# EAGLE design Nexys 2 Port Expansion Pack (EAGLE 6.5.0)
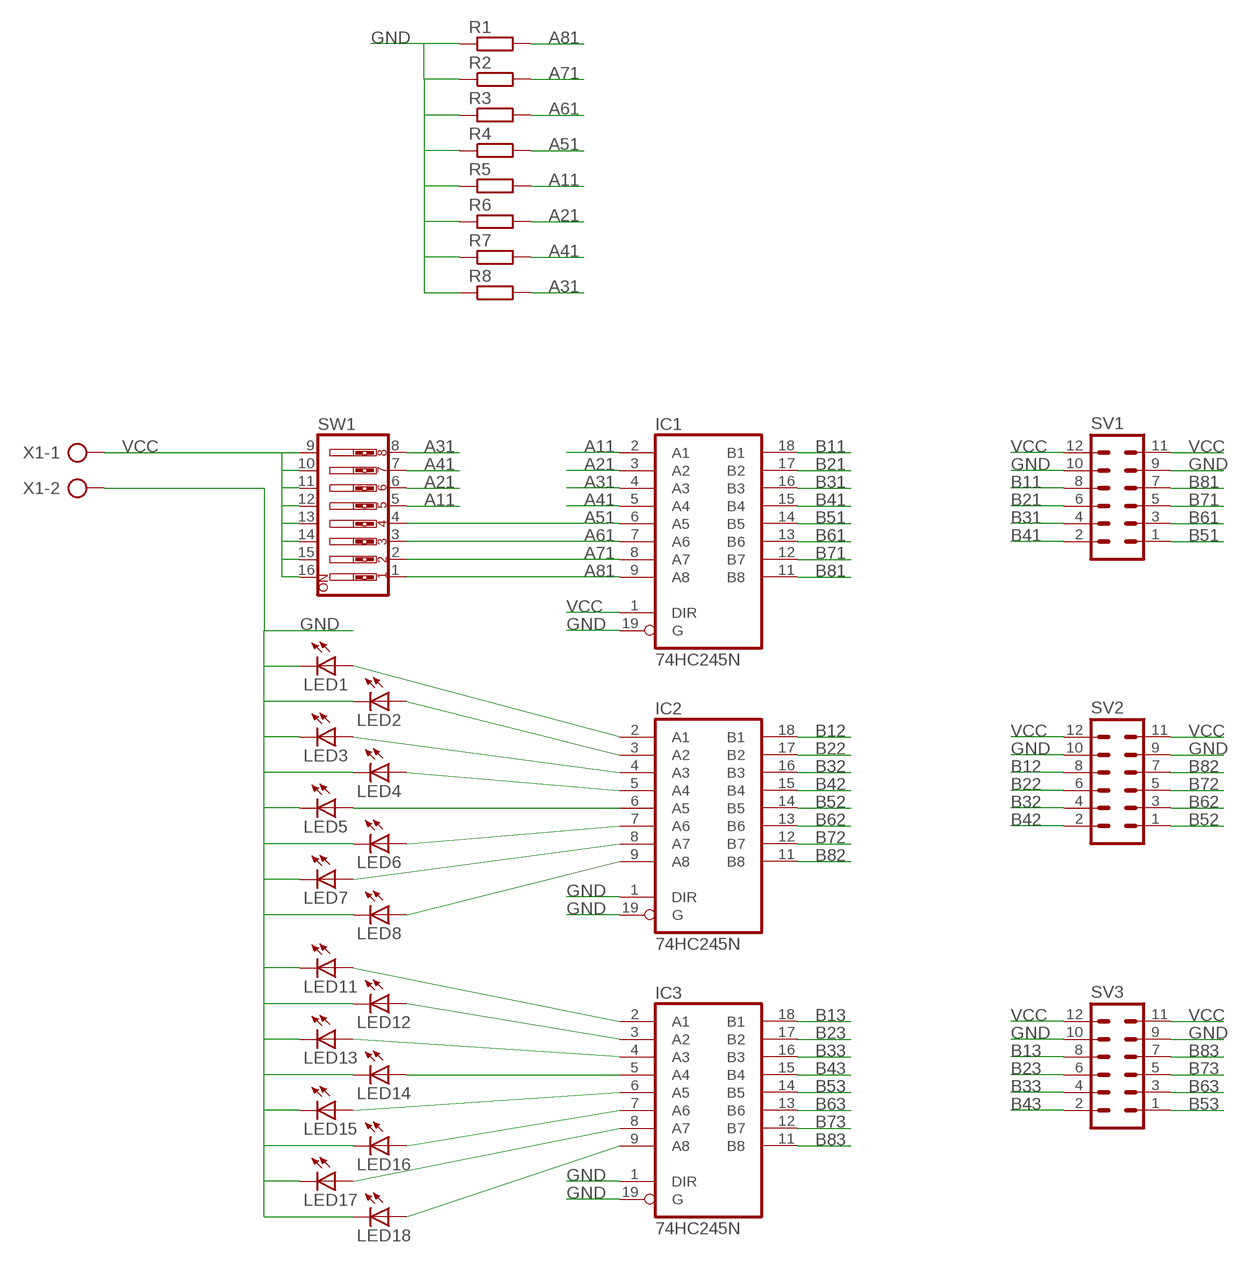
[diagram p0: schematic, sheet 1]

## Parts
IC1  74HC245N  [DIL20]
IC2  74HC245N  [DIL20]
IC3  74HC245N  [DIL20]
LED1  LED3MM  [LED3MM]
LED2  LED3MM  [LED3MM]
LED3  LED3MM  [LED3MM]
LED4  LED3MM  [LED3MM]
LED5  LED3MM  [LED3MM]
LED6  LED3MM  [LED3MM]
LED7  LED3MM  [LED3MM]
LED8  LED3MM  [LED3MM]
LED11  LED3MM  [LED3MM]
LED12  LED3MM  [LED3MM]
LED13  LED3MM  [LED3MM]
LED14  LED3MM  [LED3MM]
LED15  LED3MM  [LED3MM]
LED16  LED3MM  [LED3MM]
LED17  LED3MM  [LED3MM]
LED18  LED3MM  [LED3MM]
R1  R-EU_0207/15  [0207/15]
R2  R-EU_0207/15  [0207/15]
R3  R-EU_0207/15  [0207/15]
R4  R-EU_0207/15  [0207/15]
R5  R-EU_0207/15  [0207/15]
R6  R-EU_0207/15  [0207/15]
R7  R-EU_0207/15  [0207/15]
R8  R-EU_0207/15  [0207/15]
SV1  MA06-2  [MA06-2]
SV2  MA06-2  [MA06-2]
SV3  MA06-2  [MA06-2]
SW1  SW_DIP-8  [EDG-08]
X1  AK500/2  [AK500/2]

## Nets
A11: IC1.2(A1) R5.2 SW1.5
A21: IC1.3(A2) R6.2 SW1.6
A31: IC1.4(A3) R8.2 SW1.8
A41: IC1.5(A4) R7.2 SW1.7
A51: IC1.6(A5) R4.2 SW1.4
A61: IC1.7(A6) R3.2 SW1.3
A71: IC1.8(A7) R2.2 SW1.2
A81: IC1.9(A8) R1.2 SW1.1
B11: IC1.18(B1) SV1.8
B12: IC2.18(B1) SV2.8
B13: IC3.18(B1) SV3.8
B21: IC1.17(B2) SV1.6
B22: IC2.17(B2) SV2.6
B23: IC3.17(B2) SV3.6
B31: IC1.16(B3) SV1.4
B32: IC2.16(B3) SV2.4
B33: IC3.16(B3) SV3.4
B41: IC1.15(B4) SV1.2
B42: IC2.15(B4) SV2.2
B43: IC3.15(B4) SV3.2
B51: IC1.14(B5) SV1.1
B52: IC2.14(B5) SV2.1
B53: IC3.14(B5) SV3.1
B61: IC1.13(B6) SV1.3
B62: IC2.13(B6) SV2.3
B63: IC3.13(B6) SV3.3
B71: IC1.12(B7) SV1.5
B72: IC2.12(B7) SV2.5
B73: IC3.12(B7) SV3.5
B81: IC1.11(B8) SV1.7
B82: IC2.11(B8) SV2.7
B83: IC3.11(B8) SV3.7
GND: IC1.19(G) IC2.1(DIR) IC2.19(G) IC3.1(DIR) IC3.19(G) LED1.K(C) LED2.K(C) LED3.K(C) LED4.K(C) LED5.K(C) LED6.K(C) LED7.K(C) LED8.K(C) LED11.K(C) LED12.K(C) LED13.K(C) LED14.K(C) LED15.K(C) LED16.K(C) LED17.K(C) LED18.K(C) R1.1 R2.1 R3.1 R4.1 R5.1 R6.1 R7.1 R8.1 SV1.9 SV1.10 SV2.9 SV2.10 SV3.9 SV3.10 X1.2
N$12: IC2.2(A1) LED1.A
N$22: IC2.3(A2) LED2.A
N$23: IC3.2(A1) LED11.A
N$24: IC2.4(A3) LED3.A
N$25: IC2.5(A4) LED4.A
N$26: IC2.6(A5) LED5.A
N$27: IC2.7(A6) LED6.A
N$28: IC2.8(A7) LED7.A
N$29: IC2.9(A8) LED8.A
N$30: IC3.3(A2) LED12.A
N$31: IC3.4(A3) LED13.A
N$32: IC3.5(A4) LED14.A
N$33: IC3.6(A5) LED15.A
N$34: IC3.7(A6) LED16.A
N$35: IC3.8(A7) LED17.A
N$36: IC3.9(A8) LED18.A
VCC: IC1.1(DIR) SV1.11 SV1.12 SV2.11 SV2.12 SV3.11 SV3.12 SW1.9 SW1.10 SW1.11 SW1.12 SW1.13 SW1.14 SW1.15 SW1.16 X1.1

## Power pins joined to a net without a drawn wire
GND: IC1.10(GND) IC2.10(GND) IC3.10(GND)
VCC: IC1.20(VCC) IC2.20(VCC) IC3.20(VCC)

## Library data of the parts
IC1-IC3 = 74xx-eu:74*245: Octal BUS TRANSCEIVER, 3-state
LED1-LED8 LED11-LED18 = led:LED: LED OSRAM: - CHIPLED LG R971, LG N971, LY N971, LG Q971, LY Q971, LO R971, LY R971 LH N974, LH R974 LS Q976, LO Q976, LY Q976 LO Q996 - Hyper CHIPLED LW Q18S LB Q993, LB Q99A, LB R99A - SideLED LS A670, LO A670, LY A670, LG A670, LP A670 LB A673, LV A673, LT A673, LW A673 LH A674 LY A675 LS A676, LA A676, LO A676, LY A676, LW A676 LS A679, LY A679, LG A679 - Hyper Micro SIDELED® LS Y876, LA Y876, LO Y876, LY Y876 LT Y87S - SmartLED LW L88C, LW L88S LB L89C, LB L89S, LG L890 LS L89K, LO L89K, LY L89K LS L896, LA L896, LO L896, LY L896 - TOPLED LS T670, LO T670, LY T670, LG T670, LP T670 LSG T670, LSP T670, LSY T670, LOP T670, LYG T670 LG T671, LOG T671, LSG T671 LB T673, LV T673, LT T673, LW T673 LH T674 LS T676, LA T676, LO T676, LY T676, LB T676, LH T676, LSB T676, LW T676 LB T67C, LV T67C, LT T67C, LS T67K, LO T67K, LY T67K, LW E67C LS E67B, LA E67B, LO E67B, LY E67B, LB E67C, LV E67C, LT E67C LW T67C LS T679, LY T679, LG T679 LS T770, LO T770, LY T770, LG T770, LP T770 LB T773, LV T773, LT T773, LW T773 LH T774 LS E675, LA E675, LY E675, LS T675 LS T776, LA T776, LO T776, LY T776, LB T776 LHGB T686 LT T68C, LB T68C - Hyper Mini TOPLED® LB M676 - Mini TOPLED Santana® LG M470 LS M47K, LO M47K, LY M47K Source: http://www.osram.convergy.de LUXEON: - LUMILED® LXK2-PW12-R00, LXK2-PW12-S00, LXK2-PW14-U00, LXK2-PW14-V00 LXK2-PM12-R00, LXK2-PM12-S00, LXK2-PM14-U00 LXK2-PE12-Q00, LXK2-PE12-R00, LXK2-PE12-S00, LXK2-PE14-T00, LXK2-PE14-U00 LXK2-PB12-K00, LXK2-PB12-L00, LXK2-PB12-M00, LXK2-PB14-N00, LXK2-PB14-P00, LXK2-PB14-Q00 LXK2-PR12-L00, LXK2-PR12-M00, LXK2-PR14-Q00, LXK2-PR14-R00 LXK2-PD12-Q00, LXK2-PD12-R00, LXK2-PD12-S00 LXK2-PH12-R00, LXK2-PH12-S00 LXK2-PL12-P00, LXK2-PL12-Q00, LXK2-PL12-R00 Source: www.luxeon.com KINGBRIGHT: KA-3528ASYC Source: www.kingbright.com
R1-R8 = resistor:R-EU_: RESISTOR, European symbol
SV1-SV3 = con-lstb:MA06-2: PIN HEADER; OC_FARNELL: unknown; OC_NEWARK: unknown
SW1 = special:SW_DIP-8: DIP SWITCH
X1 = con-ptr500:AK500/2: CONNECTOR; OC_FARNELL: unknown; OC_NEWARK: unknown

## Board
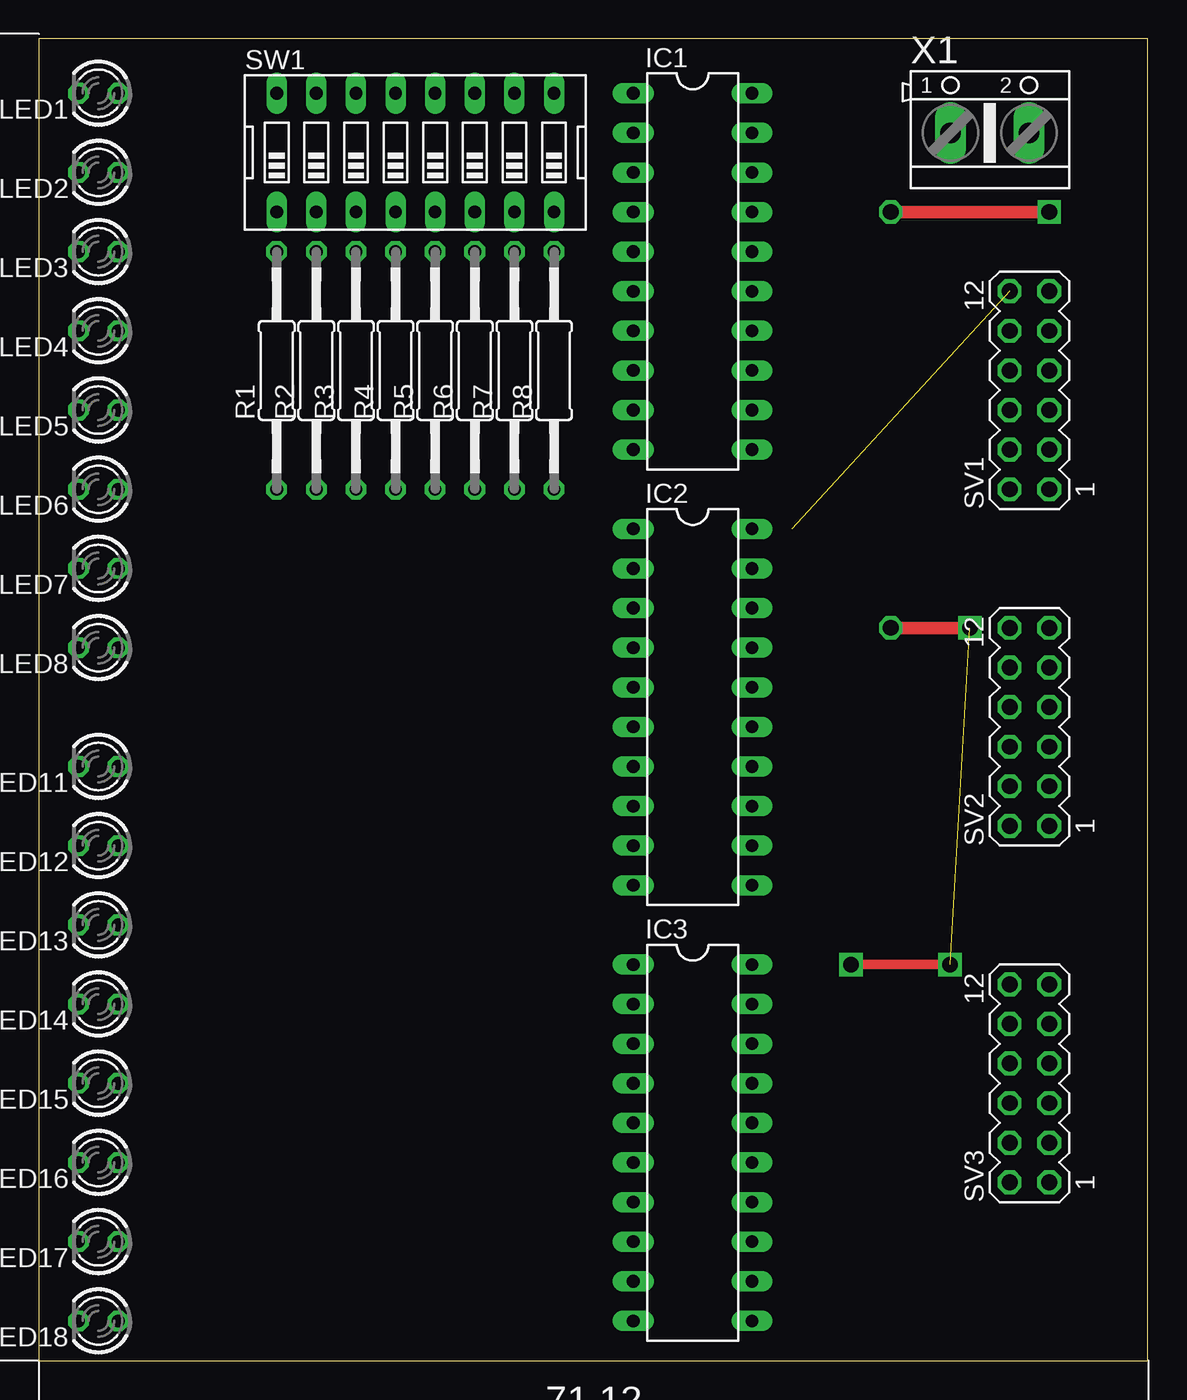
[diagram p1: board, top side]
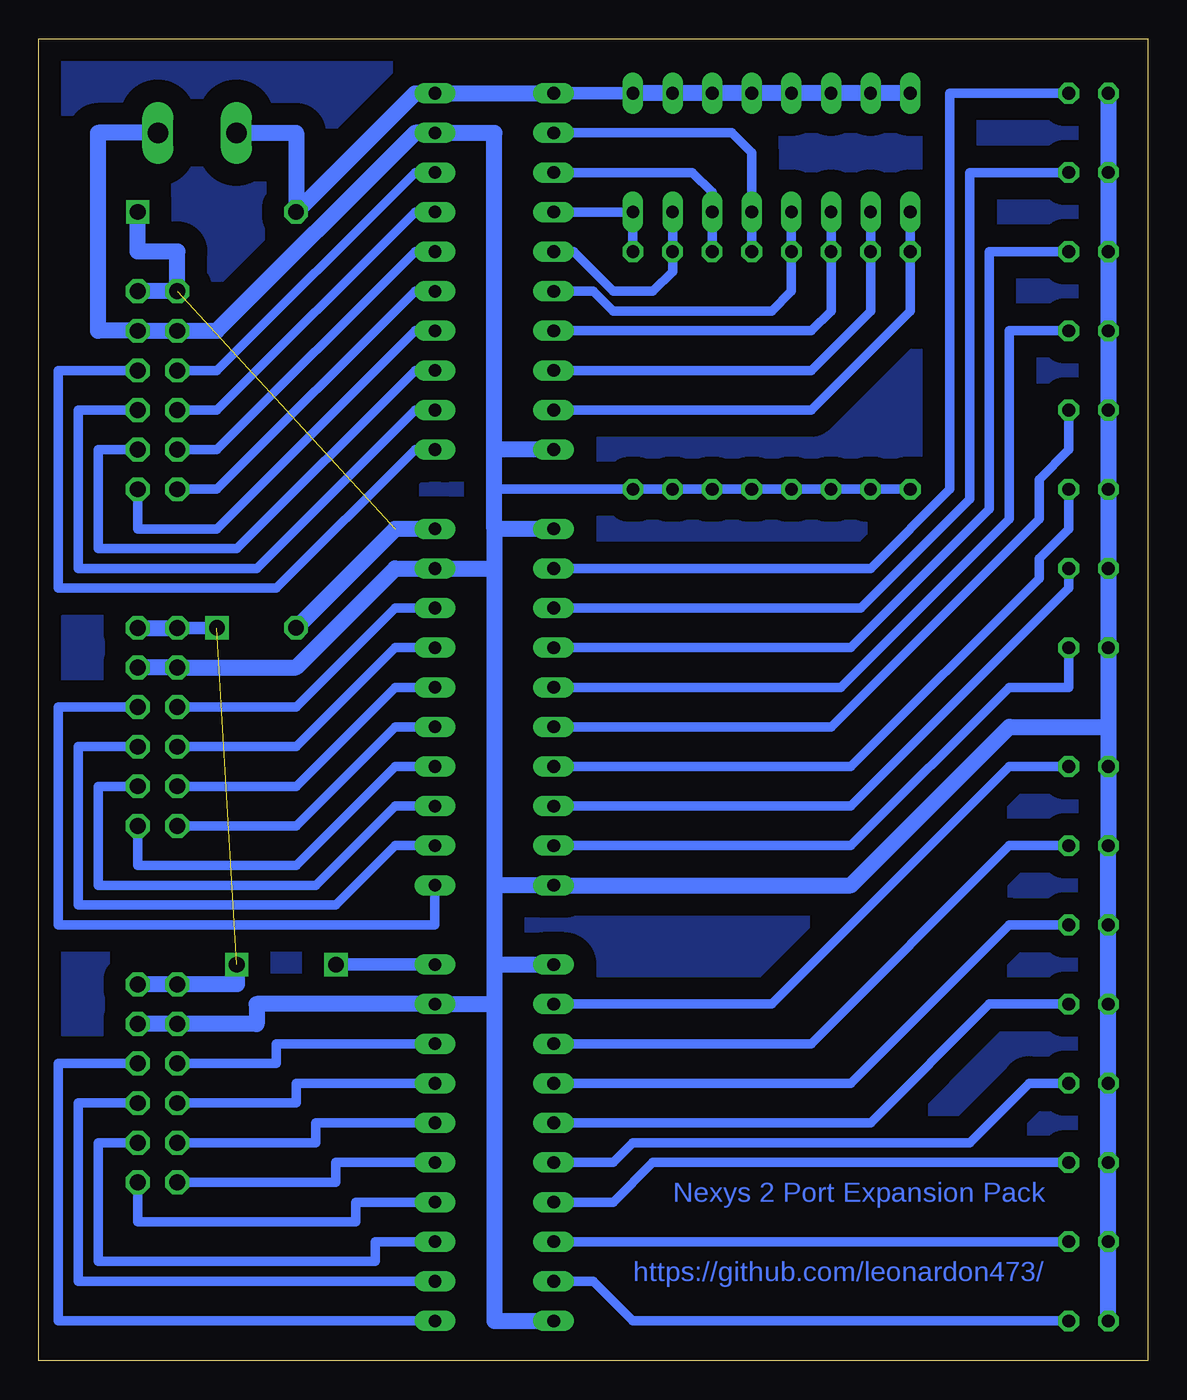
[diagram p2: board, bottom side, seen from below]

Size 71.1 x 84.76 mm. Coordinates in mm from the lower left corner, seen from the top.
Outline: 0,0 71.1,0 71.1,84.76 0,84.76 0,0
Copper layers (1*16): Top 0.035mm / dielectric 1.5mm / Bottom 0.035mm
Design rules "default": minimum track width 10mil, minimum drill 24mil, track to track 8mil, track to pad 8mil, pad to pad 8mil, via to via 8mil, smd to smd 8mil, copper to edge 40mil, drill to drill 8mil, minimum pad ring 10mil, minimum via ring 8mil, stop-mask expansion 4mil, vias tented up to drill 0mil, thermal gap 10mil

### Footprints (pad centres in the part's own frame; a part is rotated, then mirrored left to right if it is on the bottom)
DIL20 = drill 0.813 long: 1 -11.43,-3.81; 2 -8.89,-3.81; 3 -6.35,-3.81; 4 -3.81,-3.81; 5 -1.27,-3.81; 6 1.27,-3.81; 7 3.81,-3.81; 8 6.35,-3.81; 9 8.89,-3.81; 10 11.43,-3.81; 11 11.43,3.81; 12 8.89,3.81; 13 6.35,3.81; 14 3.81,3.81; 15 1.27,3.81; 16 -1.27,3.81; 17 -3.81,3.81; 18 -6.35,3.81; 19 -8.89,3.81; 20 -11.43,3.81
LED3MM = drill 0.813 octagon: A -1.27,0; K 1.27,0
0207/15 = drill 0.813 octagon: 1 -7.62,0; 2 7.62,0
MA06-2 = drill 1.016 octagon: 1 -6.35,-1.27; 2 -6.35,1.27; 3 -3.81,-1.27; 4 -3.81,1.27; 5 -1.27,-1.27; 6 -1.27,1.27; 7 1.27,-1.27; 8 1.27,1.27; 9 3.81,-1.27; 10 3.81,1.27; 11 6.35,-1.27; 12 6.35,1.27
EDG-08 = drill 0.813 long: 1 -8.89,-3.81; 2 -6.35,-3.81; 3 -3.81,-3.81; 4 -1.27,-3.81; 5 1.27,-3.81; 6 3.81,-3.81; 7 6.35,-3.81; 8 8.89,-3.81; 9 8.89,3.81; 10 6.35,3.81; 11 3.81,3.81; 12 1.27,3.81; 13 -1.27,3.81; 14 -3.81,3.81; 15 -6.35,3.81; 16 -8.89,3.81
AK500/2 = drill 1.321 long: 1 -2.515,0; 2 2.515,0

### Placement (x,y rotation side)
IC1  41.91,69.85 270 top
IC2  41.91,41.91 270 top
IC3  41.91,13.97 270 top
LED1  3.81,81.28 180 top
LED2  3.81,76.2 180 top
LED3  3.81,71.12 180 top
LED4  3.81,66.04 180 top
LED5  3.81,60.96 180 top
LED6  3.81,55.88 180 top
LED7  3.81,50.8 180 top
LED8  3.81,45.72 180 top
LED11  3.81,38.1 180 top
LED12  3.81,33.02 180 top
LED13  3.81,27.94 180 top
LED14  3.81,22.86 180 top
LED15  3.81,17.78 180 top
LED16  3.81,12.7 180 top
LED17  3.81,7.62 180 top
LED18  3.81,2.54 180 top
R1  15.24,63.5 90 top
R2  17.78,63.5 90 top
R3  20.32,63.5 90 top
R4  22.86,63.5 90 top
R5  25.4,63.5 90 top
R6  27.94,63.5 90 top
R7  30.48,63.5 90 top
R8  33.02,63.5 90 top
SV1  63.5,62.23 90 top
SV2  63.5,40.64 90 top
SV3  63.5,17.78 90 top
SW1  24.13,77.47 0 top
X1  60.96,78.74 0 top

### Tracks (layer width: path | path; a pad name or v marks a point on that pad's centre or on a via)
A11
  Bottom 0.61: R5.2 SW1.5 25.4,77.47 26.67,78.74 IC1.2
A21
  Bottom 0.61: IC1.3 29.21,76.2 27.94,74.93 SW1.6 R6.2
A31
  Bottom 0.61: IC1.4 SW1.8 R8.2
A41
  Bottom 0.61: SW1.7 R7.2 30.48,69.85 31.75,68.58 34.29,68.58 36.83,71.12 IC1.5
A51
  Bottom 0.61: SW1.4 R4.2 22.86,68.58 24.13,67.31 34.29,67.31 35.56,68.58 IC1.6
A61
  Bottom 0.61: SW1.3 R3.2 20.32,67.31 21.59,66.04 IC1.7
A71
  Bottom 0.61: SW1.2 R2.2 17.78,67.31 21.59,63.5 IC1.8
A81
  Bottom 0.61: SW1.1 R1.2 15.24,67.31 21.59,60.96 IC1.9
B11
  Bottom 0.61: SV1.8 59.69,63.5 46.99,76.2 IC1.18
B12
  Bottom 0.61: IC2.18 48.26,48.26 54.61,41.91 SV2.8
B13
  Bottom 0.61: IC3.18 55.88,20.32 55.88,19.05 SV3.8
B21
  Bottom 0.61: IC1.17 46.99,73.66 59.69,60.96 SV1.6
B22
  Bottom 0.61: SV2.6 54.61,39.37 48.26,45.72 IC2.17
B23
  Bottom 0.61: IC3.17 54.61,17.78 54.61,16.51 SV3.6
B31
  Bottom 0.61: SV1.4 59.69,58.42 46.99,71.12 IC1.16
B32
  Bottom 0.61: IC2.16 48.26,43.18 54.61,36.83 SV2.4
B33
  Bottom 0.61: IC3.16 53.34,15.24 53.34,13.97 SV3.4
B41
  Bottom 0.61: IC1.15 46.99,68.58 59.69,55.88 SV1.2
B42
  Bottom 0.61: SV2.2 54.61,34.29 48.26,40.64 IC2.15
B43
  Bottom 0.61: IC3.15 52.07,12.7 52.07,11.43 SV3.2
B51
  Bottom 0.61: SV1.1 64.77,53.34 59.69,53.34 46.99,66.04 IC1.14
B52
  Bottom 0.61: IC2.14 48.26,38.1 54.61,31.75 64.77,31.75 SV2.1
B53
  Bottom 0.61: IC3.14 50.8,10.16 50.8,8.89 64.77,8.89 SV3.1
B61
  Bottom 0.61: IC1.13 46.99,63.5 58.42,52.07 67.31,52.07 67.31,58.42 SV1.3
B62
  Bottom 0.61: SV2.3 67.31,36.83 67.31,30.48 53.34,30.48 48.26,35.56 IC2.13
B63
  Bottom 0.61: IC3.13 49.53,7.62 49.53,6.35 67.31,6.35 67.31,13.97 SV3.3
B71
  Bottom 0.61: SV1.5 68.58,60.96 68.58,50.8 57.15,50.8 46.99,60.96 IC1.12
B72
  Bottom 0.61: SV2.5 68.58,39.37 68.58,29.21 52.07,29.21 48.26,33.02 IC2.12
B73
  Bottom 0.61: IC3.12 68.58,5.08 68.58,16.51 SV3.5
B81
  Bottom 0.61: IC1.11 46.99,58.42 55.88,49.53 69.85,49.53 69.85,63.5 SV1.7
B82
  Bottom 0.61: IC2.11 45.72,27.94 69.85,27.94 69.85,41.91 SV2.7
B83
  Bottom 0.61: SV3.7 69.85,19.05 69.85,2.54 IC3.11
GND
  Bottom 0.61: SV1.9 SV1.10 | R1.1 R2.1 R3.1 R4.1 R5.1 R6.1 R7.1 R8.1 41.91,55.88
  Bottom 1.016: 41.91,53.34 41.91,50.8 | 41.91,50.8 41.91,30.48 | 41.91,30.48 41.91,25.4 | 41.91,25.4 IC3.1 | 41.91,30.48 IC2.10 19.05,30.48 8.89,40.64 2.54,40.64 | 41.91,22.86 IC3.19 57.15,22.86 57.15,21.59 SV3.10 SV3.9 | 41.91,22.86 41.91,2.54 IC3.10 | 41.91,25.4 41.91,22.86 | 41.91,58.42 41.91,78.74 IC1.19 46.99,78.74 59.69,66.04 SV1.9 67.31,66.04 67.31,78.74 X1.2 | 41.91,50.8 IC2.19 48.26,50.8 54.61,44.45 SV2.10 SV2.9 | IC1.10 41.91,58.42 | IC2.1 41.91,53.34 | 41.91,53.34 41.91,55.88 41.91,58.42 | LED1.K LED2.K LED3.K LED4.K LED5.K LED6.K LED7.K LED8.K 2.54,40.64 | LED18.K LED17.K LED16.K LED15.K LED14.K LED13.K LED12.K LED11.K 2.54,40.64
N$9
  pour Bottom (isolate 1.422): 0,83.82 71.12,83.82 71.12,0 0,0
N$12
  Bottom 0.61: LED1.A 12.7,81.28 12.7,55.88 17.78,50.8 IC2.2
N$22
  Bottom 0.61: LED2.A 11.43,76.2 11.43,55.24 18.41,48.26 IC2.3
N$23
  Bottom 0.61: IC3.2 24.13,22.86 8.89,38.1 LED11.A
N$24
  Bottom 0.61: LED3.A 10.16,71.12 10.16,54.61 19.05,45.72 IC2.4
N$25
  Bottom 0.61: LED4.A 8.89,66.04 8.89,53.98 19.68,43.18 IC2.5
N$26
  Bottom 0.61: IC2.6 20.32,40.64 6.99,53.98 6.99,56.52 5.08,58.42 LED5.A
N$27
  Bottom 0.61: IC2.7 19.05,38.1 6.99,50.16 6.99,51.44 5.08,53.34 LED6.A
N$28
  Bottom 0.61: IC2.8 19.05,35.56 5.08,49.53 LED7.A
N$29
  Bottom 0.61: IC2.9 19.05,33.02 8.89,43.18 5.08,43.18 LED8.A
N$30
  Bottom 0.61: IC3.3 21.59,20.32 8.89,33.02 LED12.A
N$31
  Bottom 0.61: IC3.4 19.05,17.78 8.89,27.94 LED13.A
N$32
  Bottom 0.61: IC3.5 17.78,15.24 10.16,22.86 LED14.A
N$33
  Bottom 0.61: IC3.6 34.29,12.7 33.02,13.97 11.43,13.97 7.62,17.78 LED15.A
N$34
  Bottom 0.61: IC3.7 34.29,10.16 31.75,12.7 LED16.A
N$35
  Bottom 0.61: IC3.8 LED17.A
N$36
  Bottom 0.61: LED18.A 33.02,2.54 35.56,5.08 IC3.9
VCC  (via drill 1)  (2 unrouted)
  Top 0.61: v58.42,25.4 v52.07,25.4
  Top 0.813: v54.61,46.99 v59.69,46.99 | v64.77,73.66 v54.61,73.66
  Bottom 0.813: IC1.1 SW1.9 | v52.07,25.4 IC3.20 | v59.69,46.99 SV2.12
  Bottom 1.016: IC1.1 IC1.20 46.99,81.28 v54.61,73.66 54.61,78.74 X1.1 | SW1.16 SW1.15 SW1.14 SW1.13 SW1.12 SW1.11 SW1.10 SW1.9 | SV2.11 SV2.12 | v58.42,25.4 58.42,24.13 SV3.12 SV3.11 | IC2.20 48.26,53.34 v54.61,46.99 | SV1.11 SV1.12 62.23,71.12 64.77,71.12 v64.77,73.66

### Text on the board
Bottom: Nexys 2 Port Expansion Pack | https://github.com/leonardon473/